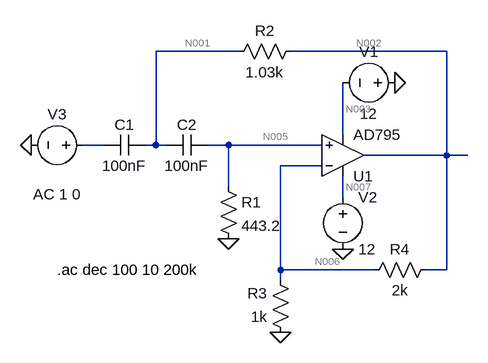
[diagram p0: schematic task3.asc]
task3.asc, the LTspice schematic file:
Version 4.1
SHEET 1 880 680
WIRE 448 144 320 144
WIRE 768 144 528 144
WIRE 608 272 608 192
WIRE 240 288 208 288
WIRE 320 288 320 144
WIRE 320 288 304 288
WIRE 336 288 320 288
WIRE 432 288 400 288
WIRE 576 288 432 288
WIRE 768 304 768 144
WIRE 768 304 640 304
WIRE 800 304 768 304
WIRE 576 320 512 320
WIRE 432 352 432 288
WIRE 608 368 608 336
WIRE 512 480 512 320
WIRE 656 480 512 480
WIRE 768 480 768 304
WIRE 768 480 736 480
WIRE 512 496 512 480
FLAG 128 288 0
FLAG 512 576 0
FLAG 432 432 0
FLAG 608 448 0
FLAG 688 192 0
SYMBOL OpAmps\\AD795 608 368 M180
SYMATTR InstName U1
SYMBOL res 752 464 R90
WINDOW 0 0 56 VBottom 2
WINDOW 3 32 56 VTop 2
SYMATTR InstName R4
SYMATTR Value 2k
SYMBOL res 528 592 R180
WINDOW 0 36 76 Left 2
WINDOW 3 36 40 Left 2
SYMATTR InstName R3
SYMATTR Value 1k
SYMBOL res 432 160 R270
WINDOW 0 32 56 VTop 2
WINDOW 3 0 56 VBottom 2
SYMATTR InstName R2
SYMATTR Value 1.03k
SYMBOL cap 304 272 R90
WINDOW 0 0 32 VBottom 2
WINDOW 3 32 32 VTop 2
SYMATTR InstName C1
SYMATTR Value 100nF
SYMBOL cap 400 272 R90
WINDOW 0 0 32 VBottom 2
WINDOW 3 32 32 VTop 2
SYMATTR InstName C2
SYMATTR Value 100nF
SYMBOL voltage 224 288 R90
WINDOW 0 -32 56 VBottom 2
WINDOW 3 32 56 VTop 2
WINDOW 123 60 56 VTop 2
WINDOW 39 0 0 Left 0
SYMATTR InstName V3
SYMATTR Value ""
SYMATTR Value2 AC 1 0
SYMBOL res 416 336 R0
SYMATTR InstName R1
SYMATTR Value 443.2
SYMBOL voltage 704 192 R90
WINDOW 0 -32 56 VBottom 2
WINDOW 3 32 56 VTop 2
SYMATTR InstName V1
SYMATTR Value 12
SYMBOL voltage 608 352 R0
SYMATTR InstName V2
SYMATTR Value 12
TEXT 168 480 Left 2 !.ac dec 100 10 200k

The netlist it stands for:
* task3.asc
X§U1 N005 N006 N007 N003 N002 AD795  ; pins In+ In- V+ V- OUT
R4 N002 N006 2k
R3 0 N006 1k
R2 N001 N002 1.03k
C1 N001 N004 100nF
C2 N005 N001 100nF
V3 N004 0 AC 1 0
R1 N005 0 443.2
V1 0 N003 12
V2 N007 0 12
.ac dec 100 10 200k
.lib ADI1.lib
.backanno
.end

* Results of the author's LTspice run, read from the files saved beside the schematic
* Operating Point, zero values left out:
*   V(n003) = -12 V
*   V(n007) = 12 V
*   I(V1) = -1.226 mA
*   I(V2) = -1.226 mA
*   Ix(u1:3) = 1.226 mA
*   Ix(u1:4) = -1.226 mA
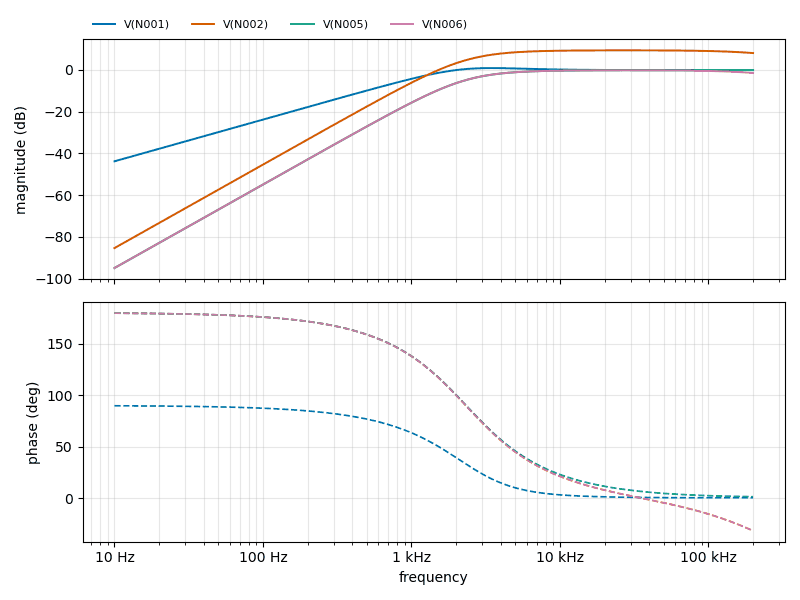
[diagram p1: AC Analysis of task3.asc, plotted from the saved traces]
* AC Analysis, 1 run:
*   V(N001): -43.78 dB at 10 Hz, -0.09 dB at 200 kHz, peak 0.87 dB at 3.467 kHz, 3 dB below the peak at 1.355 kHz
*   V(N002): -85.33 dB at 10 Hz, 8.06 dB at 200 kHz, peak 9.36 dB at 27.54 kHz, 3 dB below the peak at 2.923 kHz
*   V(N005): -94.88 dB at 10 Hz, -0.10 dB at 200 kHz, peak -0.10 dB at 200 kHz, 3 dB below the peak at 2.968 kHz
*   V(N006): -94.87 dB at 10 Hz, -1.49 dB at 200 kHz, peak -0.18 dB at 27.54 kHz, 3 dB below the peak at 2.922 kHz